# Altium schematic sheet PrNet_v04.SchDoc: PrNet v0.4
size A; DrawnBy: saquib@mit.edu
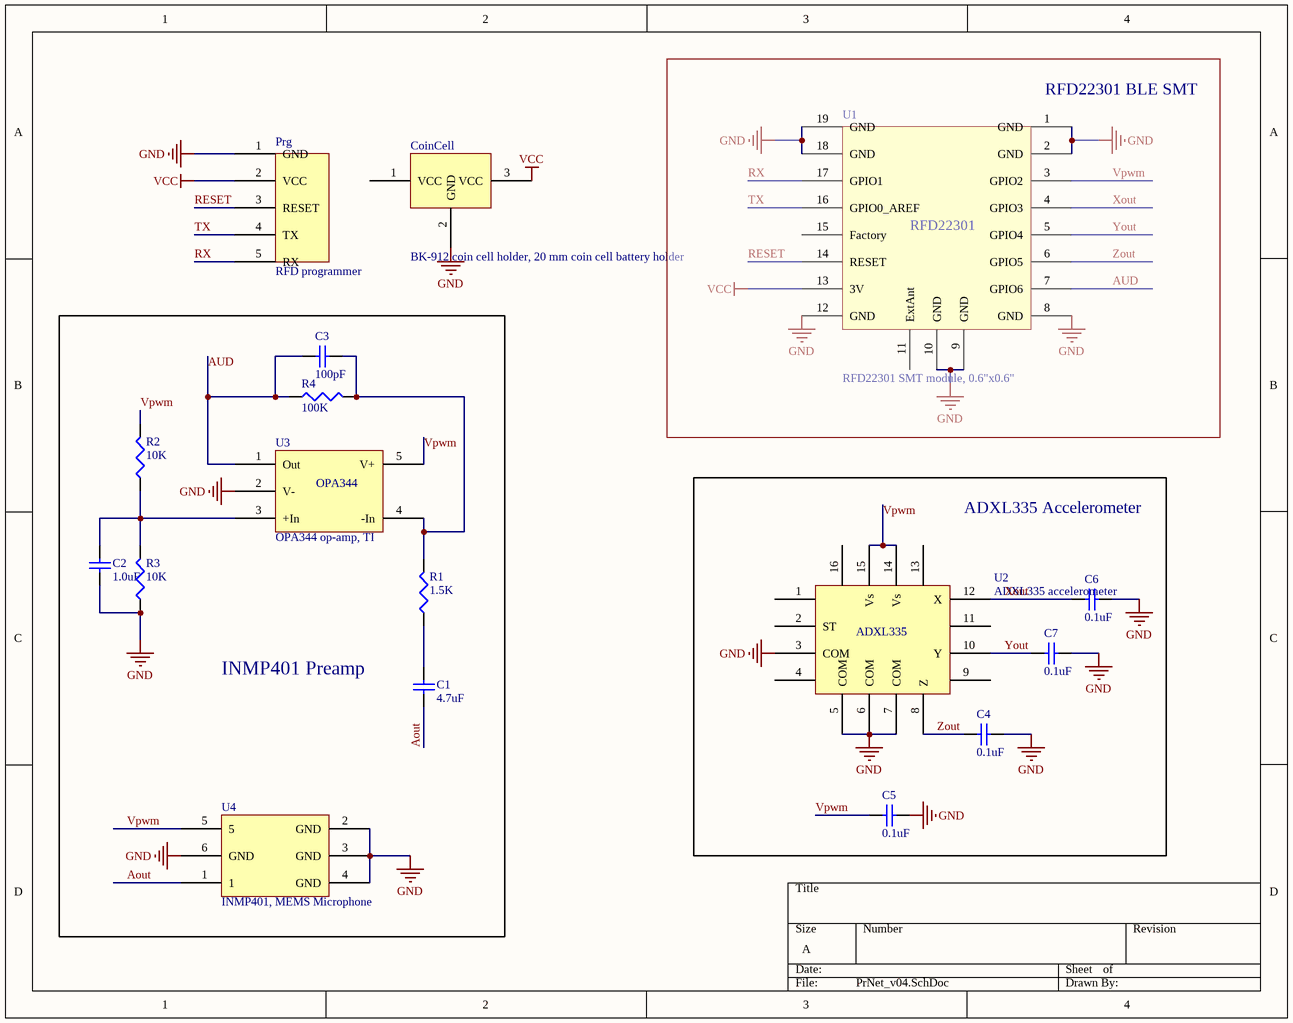
[diagram p0: PrNet_v04.SchDoc]

## Parts
C1  4.7uF  [CAPC1005L]
C2  1.0uF  [CAPC1005L]
C3  100pF  [CAPC1005L]
C4  0.1uF  [CAPC1005L]
C5  0.1uF  [CAPC1005L]
C6  0.1uF  [CAPC1005L]
C7  0.1uF  [CAPC1005L]
CoinCell  BK-912 coin cell holder, 20 mm coin cell battery holder  [CoinCell]
Prg  RFD programmer  [PrgHeader]
R1  1.5K  [RESC1005L]
R2  10K  [RESC1005L]
R3  10K  [RESC1005L]
R4  100K  [RESC1005L]
U1  RFD22301 SMT module, 0.6"x0.6"  [RFD22301]
U2  ADXL335 accelerometer  [ADXL335]
U3  OPA344 op-amp, TI  [SOT23_5]
U4  INMP401, MEMS Microphone  [INMP401]

## Blocks framed on the sheet
RFD22301 BLE SMT: U1
INMP401 Preamp: C1-C3 R1-R4 U3 U4
ADXL335 Accelerometer: C4-C7 U2

## Nets
GND: C2.1 C4.2 C5.2 C6.2 C7.2 CoinCell.2(GND) Prg.1(GND) R3.1 U1.1(GND) U1.2(GND) U1.8(GND) U1.9(GND) U1.10(GND) U1.12(GND) U1.18(GND) U1.19(GND) U2.3(COM) U2.5(COM) U2.6(COM) U2.7(COM) U3.2(V-) U4.2(GND) U4.3(GND) U4.4(GND) U4.6(GND)
VCC: CoinCell.3(VCC) Prg.2(VCC) U1.13(3V)
Aout: C1.1 U4.1
AUD: C3.1 R4.1 U1.7(GPIO6) U3.1(Out)
RESET: Prg.3(RESET) U1.14(RESET)
RX: Prg.5(RX) U1.17(GPIO1)
TX: Prg.4(TX) U1.16(GPIO0_AREF)
Vpwm: C5.1 R2.2 U1.3(GPIO2) U2.14(Vs) U2.15(Vs) U3.5(V+) U4.5
Xout: C6.1 U1.4(GPIO3) U2.12(X)
Yout: C7.1 U1.5(GPIO4) U2.10(Y)
Zout: C4.1 U1.6(GPIO5) U2.8(Z)
NetC1_2: C1.2 R1.1
NetC2_2: C2.2 R2.1 R3.2 U3.3(+In)
NetC3_2: C3.2 R1.2 R4.2 U3.4(-In)

Not connected (* = marked no-connect by the designer): CoinCell 1(VCC); U1 11(ExtAnt) 15(Factory); U2 1 2(ST) 4 9 11 13 16

## Notes on the sheet
- (in symbol RFD22301_Footprint) RFD22301

## Library data of the parts
C1-C7 = Cap Semi: Capacitor (Semiconductor SIM Model); Published: 8-Jun-2000; LatestRevisionDate: 29-May-2009; LatestRevisionNote: IPC-7351 Footprint Added.; PackageReference: C1206; Publisher: Altium Limited; PackageDescription: Chip Capacitor
  C1: Value: 4.7uF
  C2: Value: 1.0uF
  C3: Value: 100pF
  C4-C7: Value: 0.1uF
CoinCell = CoinCellHolder
Prg = Component_1
R1-R4 = Res3: Resistor; Published: 8-Jun-2000; LatestRevisionDate: 29-May-2009; LatestRevisionNote: IPC-7351 Footprint Added.; PackageReference: J1-0603; Publisher: Altium Limited; PackageDescription: Chip Resistor
  R1: Value: 1.5K
  R2 R3: Value: 10K
  R4: Value: 100K
U1 = RFD22301_Footprint
U2 = ADXL335
U3 = OPA344
U4 = INMP401